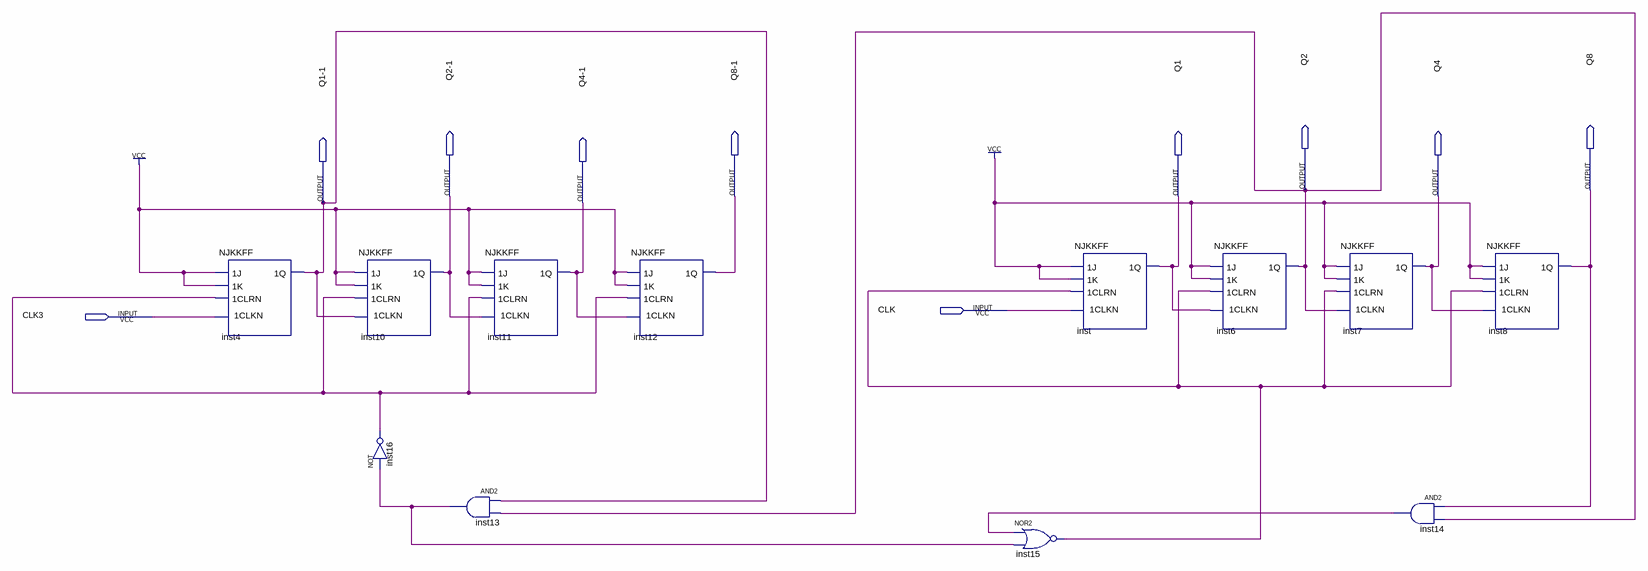
[diagram p0: schematic sheet]
// Quartus schematic mod12.bdf as structural Verilog: 12 symbols, 10 pins
module mod12 (
  input  CLK,
  input  CLK3,
  output Q2,
  output Q8,
  output \Q2-1 ,
  output \Q8-1 ,
  output Q1,
  output Q4,
  output \Q1-1 ,
  output \Q4-1 
);

  wire inst13_out, inst14_out, inst15_out, inst16_out;

  NJKKFF inst4 (.\1J (1'b1), .\1K (1'b1), .\1CLKN (CLK3), .\1CLRN (inst16_out), .\1Q (\Q1-1 ));
  NJKKFF inst10 (.\1J (1'b1), .\1K (1'b1), .\1CLKN (\Q1-1 ), .\1CLRN (inst16_out), .\1Q (\Q2-1 ));
  not inst16 (inst16_out, inst13_out);
  and inst13 (inst13_out, \Q1-1 , Q2);
  NJKKFF inst11 (.\1J (1'b1), .\1K (1'b1), .\1CLKN (\Q2-1 ), .\1CLRN (inst16_out), .\1Q (\Q4-1 ));
  NJKKFF inst12 (.\1J (1'b1), .\1K (1'b1), .\1CLKN (\Q4-1 ), .\1CLRN (inst16_out), .\1Q (\Q8-1 ));
  nor inst15 (inst15_out, inst14_out, inst13_out);
  NJKKFF inst (.\1J (1'b1), .\1K (1'b1), .\1CLKN (CLK), .\1CLRN (inst15_out), .\1Q (Q1));
  NJKKFF inst6 (.\1J (1'b1), .\1K (1'b1), .\1CLKN (Q1), .\1CLRN (inst15_out), .\1Q (Q2));
  NJKKFF inst7 (.\1J (1'b1), .\1K (1'b1), .\1CLKN (Q2), .\1CLRN (inst15_out), .\1Q (Q4));
  and inst14 (inst14_out, Q8, Q2);
  NJKKFF inst8 (.\1J (1'b1), .\1K (1'b1), .\1CLKN (Q4), .\1CLRN (inst15_out), .\1Q (Q8));
endmodule
